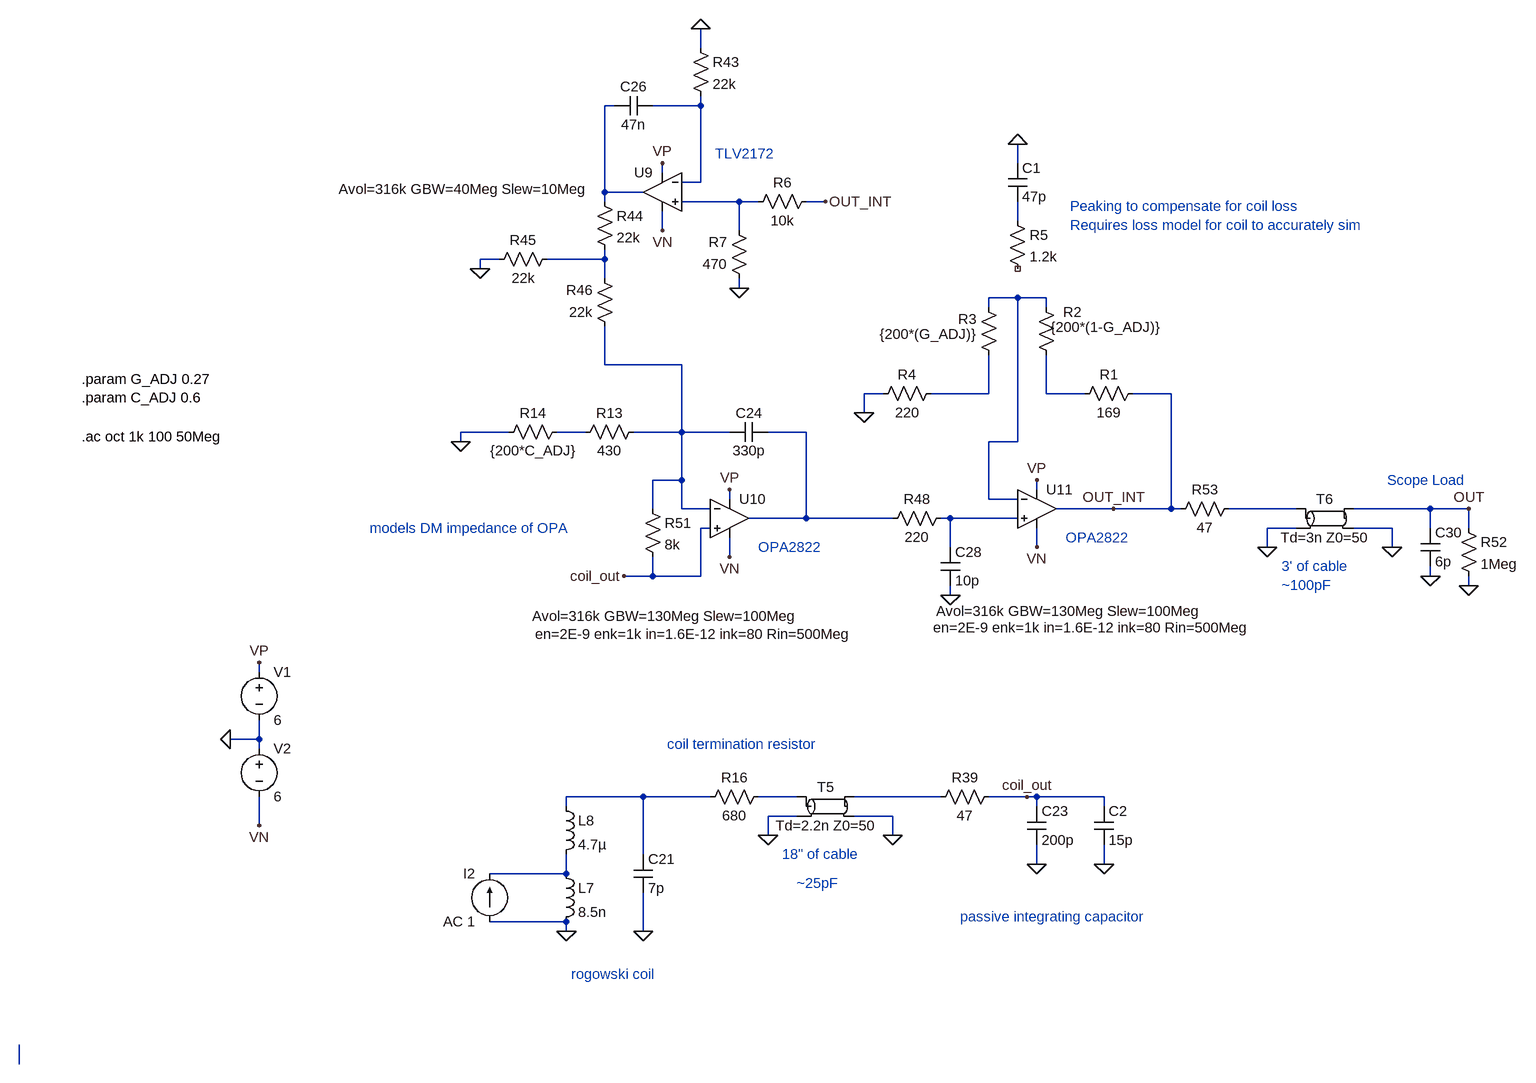
[diagram p0: schematic amp_sim_freq.asc]
amp_sim_freq.asc, the LTspice schematic file:
Version 4
SHEET 1 5332 1112
WIRE 3008 -1600 3008 -1632
WIRE 2864 -1504 2848 -1504
WIRE 3008 -1504 3008 -1520
WIRE 3008 -1504 2928 -1504
WIRE 3536 -1408 3536 -1440
WIRE 2944 -1392 2944 -1408
WIRE 3008 -1376 3008 -1504
WIRE 3008 -1376 2976 -1376
WIRE 2848 -1360 2848 -1504
WIRE 2912 -1360 2848 -1360
WIRE 2848 -1344 2848 -1360
WIRE 3072 -1344 2976 -1344
WIRE 3104 -1344 3072 -1344
WIRE 3216 -1344 3184 -1344
WIRE 3536 -1312 3536 -1344
WIRE 2944 -1296 2944 -1328
WIRE 3072 -1296 3072 -1344
WIRE 2672 -1248 2640 -1248
WIRE 2848 -1248 2848 -1264
WIRE 2848 -1248 2752 -1248
WIRE 2640 -1232 2640 -1248
WIRE 2848 -1216 2848 -1248
WIRE 3072 -1200 3072 -1216
WIRE 3536 -1184 3488 -1184
WIRE 3584 -1184 3536 -1184
WIRE 3488 -1168 3488 -1184
WIRE 3584 -1168 3584 -1184
WIRE 2848 -1072 2848 -1136
WIRE 2976 -1072 2848 -1072
WIRE 3312 -1024 3280 -1024
WIRE 3488 -1024 3488 -1088
WIRE 3488 -1024 3392 -1024
WIRE 3584 -1024 3584 -1088
WIRE 3648 -1024 3584 -1024
WIRE 3792 -1024 3728 -1024
WIRE 3280 -992 3280 -1024
WIRE 2688 -960 2608 -960
WIRE 2816 -960 2768 -960
WIRE 2976 -960 2976 -1072
WIRE 2976 -960 2896 -960
WIRE 3056 -960 2976 -960
WIRE 3184 -960 3120 -960
WIRE 2608 -944 2608 -960
WIRE 3536 -944 3536 -1184
WIRE 3536 -944 3488 -944
WIRE 2976 -880 2976 -960
WIRE 2976 -880 2928 -880
WIRE 3568 -864 3568 -880
WIRE 3056 -848 3056 -864
WIRE 3488 -848 3488 -944
WIRE 3536 -848 3488 -848
WIRE 2928 -832 2928 -880
WIRE 2976 -832 2976 -880
WIRE 3024 -832 2976 -832
WIRE 3696 -832 3600 -832
WIRE 3792 -832 3792 -1024
WIRE 3792 -832 3696 -832
WIRE 3808 -832 3792 -832
WIRE 4000 -832 3888 -832
WIRE 4224 -832 4096 -832
WIRE 4288 -832 4224 -832
WIRE 3184 -816 3184 -960
WIRE 3184 -816 3088 -816
WIRE 3328 -816 3184 -816
WIRE 3424 -816 3408 -816
WIRE 3536 -816 3424 -816
WIRE 3024 -800 3008 -800
WIRE 4000 -800 3952 -800
WIRE 4160 -800 4096 -800
WIRE 4224 -800 4224 -832
WIRE 4288 -800 4288 -832
WIRE 3424 -768 3424 -816
WIRE 3568 -768 3568 -800
WIRE 3952 -768 3952 -800
WIRE 4160 -768 4160 -800
WIRE 3056 -752 3056 -784
WIRE 2928 -720 2928 -752
WIRE 2928 -720 2880 -720
WIRE 3008 -720 3008 -800
WIRE 3008 -720 2928 -720
WIRE 4224 -720 4224 -736
WIRE 4288 -704 4288 -720
WIRE 3424 -688 3424 -704
WIRE 2272 -560 2272 -576
WIRE 2272 -448 2272 -480
WIRE 2272 -448 2224 -448
WIRE 2272 -432 2272 -448
WIRE 2912 -352 2784 -352
WIRE 3024 -352 2912 -352
WIRE 3168 -352 3104 -352
WIRE 3408 -352 3264 -352
WIRE 3552 -352 3488 -352
WIRE 3568 -352 3552 -352
WIRE 3680 -352 3568 -352
WIRE 2784 -336 2784 -352
WIRE 3568 -336 3568 -352
WIRE 3680 -336 3680 -352
WIRE 3168 -320 3120 -320
WIRE 3328 -320 3264 -320
WIRE 2272 -304 2272 -352
WIRE 3120 -288 3120 -320
WIRE 3328 -288 3328 -320
WIRE 2912 -256 2912 -352
WIRE 3568 -240 3568 -272
WIRE 3680 -240 3680 -272
WIRE 2784 -224 2784 -256
WIRE 2784 -224 2656 -224
WIRE 2784 -144 2656 -144
WIRE 2784 -128 2784 -144
WIRE 2912 -128 2912 -192
WIRE 512 400 512 368
FLAG 2224 -448 0
FLAG 2272 -576 VP
FLAG 2272 -304 VN
FLAG 2912 -128 0
FLAG 2784 -128 0
FLAG 3120 -288 0
FLAG 3328 -288 0
FLAG 3568 -240 0
FLAG 3552 -352 coil_out
FLAG 3056 -864 VP
FLAG 3056 -752 VN
FLAG 2944 -1408 VP
FLAG 2944 -1296 VN
FLAG 3008 -1632 0
FLAG 2640 -1232 0
FLAG 3568 -880 VP
FLAG 3568 -768 VN
FLAG 3424 -688 0
FLAG 2880 -720 coil_out
FLAG 3952 -768 0
FLAG 4160 -768 0
FLAG 4224 -720 0
FLAG 4288 -704 0
FLAG 3280 -992 0
FLAG 3536 -1440 0
FLAG 3072 -1200 0
FLAG 3216 -1344 OUT_INT
FLAG 3696 -832 OUT_INT
FLAG 2608 -944 0
FLAG 4288 -832 OUT
FLAG 3680 -240 0
SYMBOL voltage 2272 -576 R0
WINDOW 123 0 0 Left 0
WINDOW 39 0 0 Left 0
SYMATTR InstName V1
SYMATTR Value 6
SYMBOL voltage 2272 -448 R0
WINDOW 123 0 0 Left 0
WINDOW 39 0 0 Left 0
SYMATTR InstName V2
SYMATTR Value 6
SYMBOL ind 2768 -240 R0
SYMATTR InstName L7
SYMATTR Value 8.5n
SYMATTR SpiceLine Rser=0
SYMBOL ind 2768 -352 R0
SYMATTR InstName L8
SYMATTR Value 4.7µ
SYMBOL cap 2896 -256 R0
SYMATTR InstName C21
SYMATTR Value 7p
SYMBOL res 3120 -368 R90
WINDOW 0 0 56 VBottom 2
WINDOW 3 32 56 VTop 2
SYMATTR InstName R16
SYMATTR Value 680
SYMBOL res 3504 -368 R90
WINDOW 0 0 56 VBottom 2
WINDOW 3 32 56 VTop 2
SYMATTR InstName R39
SYMATTR Value 47
SYMBOL tline 3216 -336 R0
SYMATTR InstName T5
SYMATTR Value Td=2.2n Z0=50
SYMBOL cap 3552 -336 R0
SYMATTR InstName C23
SYMATTR Value 200p
SYMBOL cap 3120 -976 R90
WINDOW 0 0 32 VBottom 2
WINDOW 3 32 32 VTop 2
SYMATTR InstName C24
SYMATTR Value 330p
SYMBOL res 2992 -1616 R0
SYMATTR InstName R43
SYMATTR Value 22k
SYMBOL cap 2928 -1520 R90
WINDOW 0 0 32 VBottom 2
WINDOW 3 32 32 VTop 2
SYMATTR InstName C26
SYMATTR Value 47n
SYMBOL res 2832 -1360 R0
SYMATTR InstName R44
SYMATTR Value 22k
SYMBOL res 2768 -1264 R90
WINDOW 0 0 56 VBottom 2
WINDOW 3 32 56 VTop 2
SYMATTR InstName R45
SYMATTR Value 22k
SYMBOL res 2864 -1120 R180
WINDOW 0 36 76 Left 2
WINDOW 3 36 40 Left 2
SYMATTR InstName R46
SYMATTR Value 22k
SYMBOL res 3424 -832 R90
WINDOW 0 0 56 VBottom 2
WINDOW 3 32 56 VTop 2
SYMATTR InstName R48
SYMATTR Value 220
SYMBOL cap 3408 -768 R0
SYMATTR InstName C28
SYMATTR Value 10p
SYMBOL OpAmps\\UniversalOpamp2 2944 -1360 M0
WINDOW 123 127 -5 Left 2
SYMATTR Value2 Avol=316k GBW=40Meg Slew=10Meg
SYMATTR InstName U9
SYMATTR SpiceLine2 en=1E-9 enk=25 in=0.04E-12 ink=2k Rin=500Meg
SYMBOL res 2912 -848 R0
SYMATTR InstName R51
SYMATTR Value 8k
SYMBOL OpAmps\\UniversalOpamp2 3056 -816 R0
WINDOW 123 -329 163 Left 2
WINDOW 40 -324 193 Left 2
SYMATTR Value2 Avol=316k GBW=130Meg Slew=100Meg
SYMATTR SpiceLine2 en=2E-9 enk=1k in=1.6E-12 ink=80 Rin=500Meg
SYMATTR InstName U10
SYMATTR SpiceLine ilimit=80m rail=0 Vos=0 phimargin=45
SYMBOL tline 4048 -816 R0
SYMATTR InstName T6
SYMATTR Value Td=3n Z0=50
SYMBOL res 4272 -816 R0
SYMATTR InstName R52
SYMATTR Value 1Meg
SYMBOL cap 4208 -800 R0
SYMATTR InstName C30
SYMATTR Value 6p
SYMBOL res 3904 -848 R90
WINDOW 0 0 56 VBottom 2
WINDOW 3 32 56 VTop 2
SYMATTR InstName R53
SYMATTR Value 47
SYMBOL OpAmps\\UniversalOpamp2 3568 -832 R0
WINDOW 123 -168 171 Left 2
WINDOW 40 -173 198 Left 2
SYMATTR Value2 Avol=316k GBW=130Meg Slew=100Meg
SYMATTR SpiceLine2 en=2E-9 enk=1k in=1.6E-12 ink=80 Rin=500Meg
SYMATTR InstName U11
SYMATTR SpiceLine ilimit=80m rail=0 Vos=0 phimargin=45
SYMBOL current 2656 -144 R180
WINDOW 0 24 80 Left 2
WINDOW 3 24 0 Left 2
WINDOW 123 0 0 Left 0
WINDOW 39 0 0 Left 0
SYMATTR InstName I2
SYMATTR Value AC 1
SYMBOL res 3744 -1040 R90
WINDOW 0 0 56 VBottom 2
WINDOW 3 32 56 VTop 2
SYMATTR InstName R1
SYMATTR Value 169
SYMBOL res 3600 -1072 R180
WINDOW 0 -43 88 Left 2
WINDOW 3 -173 63 Left 2
SYMATTR InstName R2
SYMATTR Value {200*(1-G_ADJ)}
SYMBOL res 3504 -1072 R180
WINDOW 0 36 76 Left 2
WINDOW 3 38 51 Left 2
SYMATTR InstName R3
SYMATTR Value {200*(G_ADJ)}
SYMBOL res 3408 -1040 R90
WINDOW 0 0 56 VBottom 2
WINDOW 3 32 56 VTop 2
SYMATTR InstName R4
SYMATTR Value 220
SYMBOL res 3520 -1328 R0
SYMATTR InstName R5
SYMATTR Value 1.2k
SYMBOL cap 3520 -1408 R0
SYMATTR InstName C1
SYMATTR Value 47p
SYMBOL res 3200 -1360 R90
WINDOW 0 0 56 VBottom 2
WINDOW 3 32 56 VTop 2
SYMATTR InstName R6
SYMATTR Value 10k
SYMBOL res 3088 -1200 R180
WINDOW 0 36 76 Left 2
WINDOW 3 36 40 Left 2
SYMATTR InstName R7
SYMATTR Value 470
SYMBOL res 2912 -976 R90
WINDOW 0 0 56 VBottom 2
WINDOW 3 32 56 VTop 2
SYMATTR InstName R13
SYMATTR Value 430
SYMBOL res 2784 -976 R90
WINDOW 0 0 56 VBottom 2
WINDOW 3 32 56 VTop 2
SYMATTR InstName R14
SYMATTR Value {200*C_ADJ}
SYMBOL cap 3664 -336 R0
SYMATTR InstName C2
SYMATTR Value 15p
TEXT 1976 -952 Left 2 !.ac oct 1k 100 50Meg
TEXT 3144 -256 Left 2 ;18" of cable
TEXT 2952 -440 Left 2 ;coil termination resistor
TEXT 3440 -152 Left 2 ;passive integrating capacitor
TEXT 3168 -208 Left 2 ;~25pF
TEXT 2456 -800 Left 2 ;models DM impedance of OPA
TEXT 3976 -736 Left 2 ;3' of cable\n~100pF
TEXT 3624 -1336 Left 2 ;Peaking to compensate for coil loss\nRequires loss model for coil to accurately sim
TEXT 4152 -880 Left 2 ;Scope Load
TEXT 1976 -1048 Left 2 !.param G_ADJ 0.27\n.param C_ADJ 0.6
TEXT 3104 -768 Left 2 ;OPA2822
TEXT 3616 -784 Left 2 ;OPA2822
TEXT 3032 -1424 Left 2 ;TLV2172
TEXT 2792 -56 Left 2 ;rogowski coil

The netlist it stands for:
* amp_sim_freq.asc
V1 VP 0 6
V2 0 VN 6
L7 N017 0 8.5n Rser=0
L8 N014 N017 4.7µ
C21 N014 0 7p
R16 N015 N014 680
R39 coil_out N016 47
T5 N015 0 N016 0 Td=2.2n Z0=50
C23 coil_out 0 200p
C24 N011 N007 330p
R43 0 N002 22k
C26 N002 N001 47n
R44 N001 N005 22k
R45 N005 0 22k
R46 N007 N005 22k
R48 N013 N011 220
C28 N013 0 10p
XU9 N003 N002 VP VN N001 level.2 Avol=316k GBW=40Meg Slew=10Meg ilimit=25m rail=0 Vos=0 phimargin=45 en=1E-9 enk=25 in=0.04E-12 ink=2k Rin=500Meg  ; pins IN+ IN- V+ V- OUT
R51 N007 coil_out 8k
XU10 coil_out N007 VP VN N011 level.2 Avol=316k GBW=130Meg Slew=100Meg ilimit=80m rail=0 Vos=0 phimargin=45 en=2E-9 enk=1k in=1.6E-12 ink=80 Rin=500Meg  ; pins IN+ IN- V+ V- OUT
T6 N012 0 OUT 0 Td=3n Z0=50
R52 OUT 0 1Meg
C30 OUT 0 6p
R53 N012 OUT_INT 47
XU11 N013 N006 VP VN OUT_INT level.2 Avol=316k GBW=130Meg Slew=100Meg ilimit=80m rail=0 Vos=0 phimargin=45 en=2E-9 enk=1k in=1.6E-12 ink=80 Rin=500Meg  ; pins IN+ IN- V+ V- OUT
I2 0 N017 AC 1
R1 OUT_INT N009 169
R2 N009 N006 {200*(1-G_ADJ)}
R3 N008 N006 {200*(G_ADJ)}
R4 N008 0 220
R5 N004 NC_01 1.2k
C1 0 N004 47p
R6 OUT_INT N003 10k
R7 0 N003 470
R13 N007 N010 430
R14 N010 0 {200*C_ADJ}
C2 coil_out 0 15p
.ac oct 1k 100 50Meg
* 18" of cable
* coil termination resistor
* passive integrating capacitor
* ~25pF
* models DM impedance of OPA
* 3' of cable
* ~100pF
* Peaking to compensate for coil loss
* Requires loss model for coil to accurately sim
* Scope Load
.param G_ADJ 0.27
.param C_ADJ 0.6
* OPA2822
* OPA2822
* TLV2172
* rogowski coil
.lib UniversalOpamps2.sub
.backanno
.end